# EAGLE design Callisto_MSO (EAGLE 9.6.2)
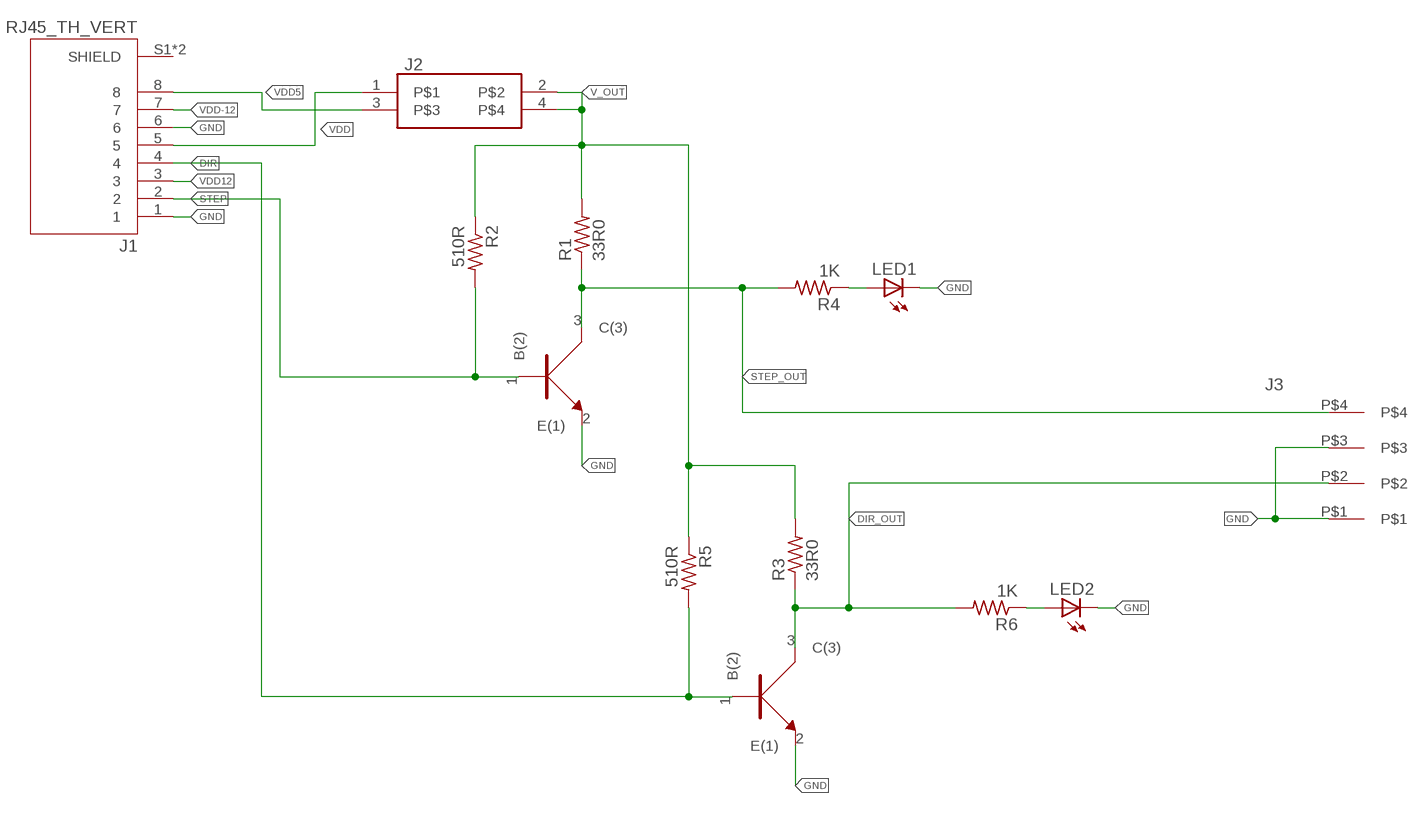
[diagram p0: schematic, sheet 1]

## Parts
J1  RJ45_TH_VERT  [ASSMANN_A-2014-2S-4-N-R]
J2  2.54MM_2_X_2_HEADER_GENERIC  [2X2]
J3  4-pos  3.81MM_1_X_4_RT_ANGLE_PLUG_HEADER  [1X4_3.81MM_PITCH]
LED1  Green  LED_0805_GREEN  [0805]
LED2  Green  LED_0805_GREEN  [0805]
R1  33R0  R_0402_1K0  [0402]
R2  510R  R_0402_1K0  [0402]
R3  33R0  R_0402_1K0  [0402]
R4  1K  R_0402_470R0  [0402]
R5  510R  R_0402_1K0  [0402]
R6  1K  R_0402_470R0  [0402]
U1  NPN  BC846BW  [SOT323]
U2  NPN  BC846BW  [SOT323]

## Nets
DIR: J1.4 R5.P$2 U2.1(B(2))
DIR_OUT: J3.P$2 R3.P$1 R6.P$2 U2.3(C(3))
GND: J1.1 J1.6 J3.P$1 J3.P$3 LED1.2(C) LED2.2(C) U1.2(E(1)) U2.2(E(1))
N$1: LED2.1(A) R6.P$1
N$2: LED1.1(A) R4.P$1
STEP: J1.2 R2.P$2 U1.1(B(2))
STEP_OUT: J3.P$4 R1.P$1 R4.P$2 U1.3(C(3))
V_OUT: J2.2 J2.4 R1.P$2 R2.P$1 R3.P$2 R5.P$1
VDD: J1.5 J2.1
VDD5: J1.8 J2.3
VDD12: J1.3
VDD-12: J1.7
Unconnected: J1.S1(SHIELD) J1.S2(SHIELD)

## Library data of the parts
J1 = 3D_MIG_Controller:RJ45_TH_VERT: Jack Modular Connector 8p8c (RJ45, Ethernet) Vertical Shielded; DESCRIPTION: Jack Modular Connector 8p8c (RJ45, Ethernet) Vertical Shielded; DIGI-KEY_PART_NUMBER: AE10399-ND; MF: Assmann WSW Components; MP: A-2014-2S-4-N-R; PACKAGE: None
J2 = 3D_MIG_Controller:2.54MM_2_X_2_HEADER_GENERIC
J3 = 3D_MIG_Controller:3.81MM_1_X_4_RT_ANGLE_PLUG_HEADER: 4 Position Terminal Block Header, Male Pins, Shrouded (4 Side) 0.150" (3.81mm) 90°, Right Angle - Through Hole; PARTNO: 691322310004
LED1 LED2 = 3D_MIG_Controller:LED_0805_GREEN: Green 570nm LED Indication - Discrete 2.2V 0805 (2012 Metric); PARTNO: LG R971-KN-1
R1-R3 R5 = 3D_MIG_Controller:R_0402_1K0; PARTNO: CRG0402J1K0; VALUE: 1K0
R4 R6 = 3D_MIG_Controller:R_0402_470R0; PARTNO: RMCF0402JT470R; VALUE: 470R0
U1 U2 = 3D_MIG_Controller:BC846BW: Bipolar (BJT) Transistor NPN 100MHz Surface Mount SOT-323; PARTNO: BC846BW_NPN

## Board
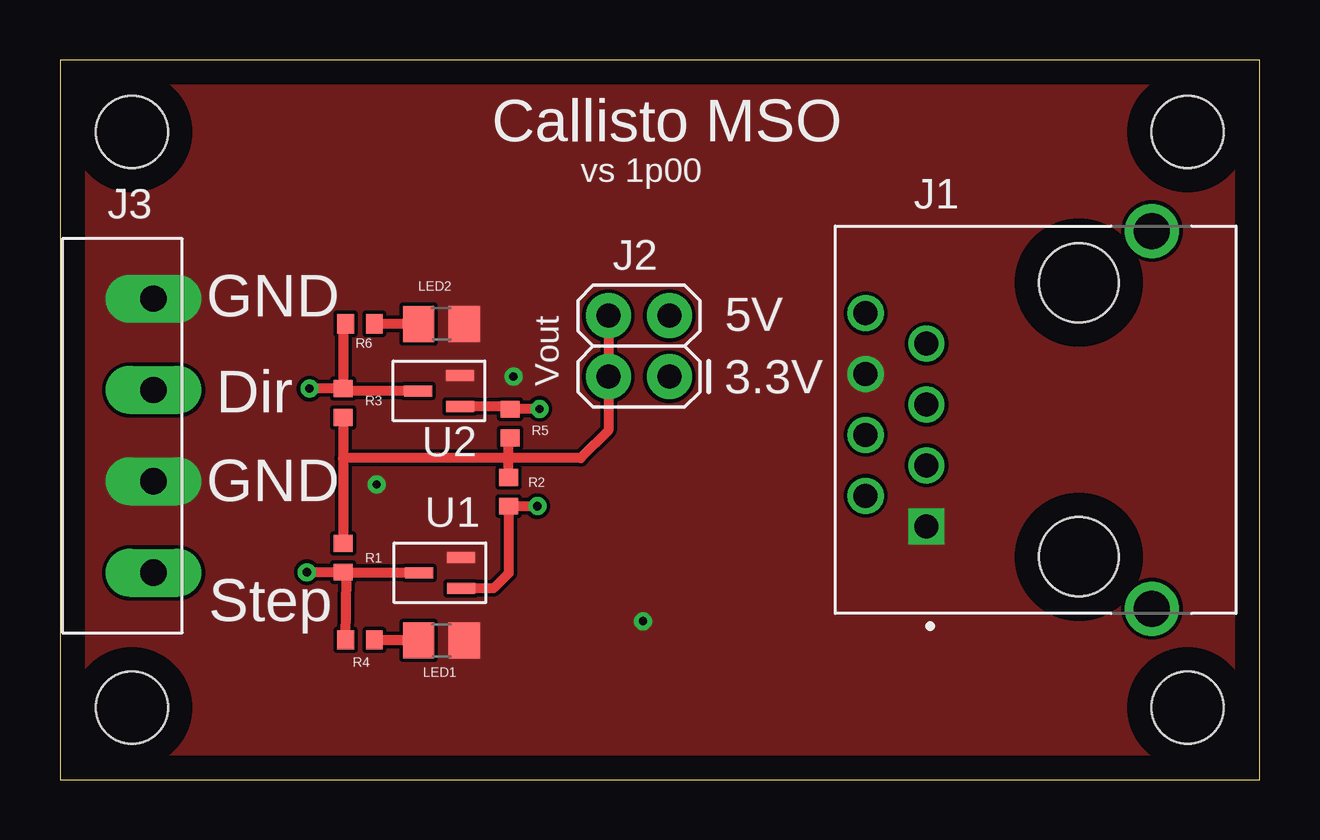
[diagram p1: board, top side]
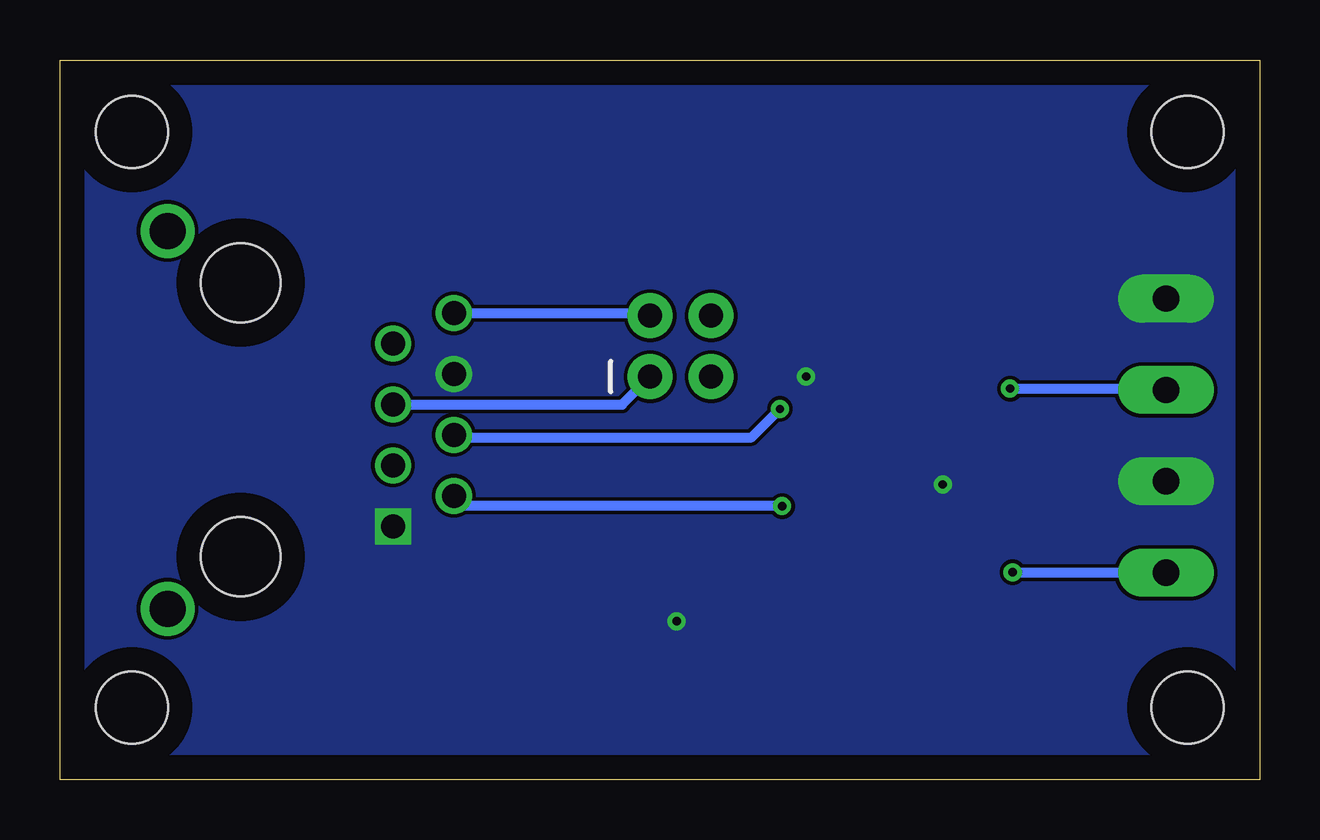
[diagram p2: board, bottom side, seen from below]

Size 50 x 30 mm. Coordinates in mm from the lower left corner, seen from the top.
Outline: 0,0 50,0 50,30 0,30 0,0
Copper layers (1*16): Top 0.035mm / dielectric 1.5mm / Bottom 0.035mm
Design rules "default": minimum track width 6mil, minimum drill 0.35mm, track to track 6mil, track to pad 6mil, pad to pad 6mil, via to via 6mil, smd to smd 6mil, copper to edge 40mil, drill to drill 6mil, minimum pad ring 10mil, minimum via ring 8mil, stop-mask expansion 4mil, vias tented up to drill 0mil, thermal gap 10mil
Holes 3 mm at 3,3 47,3 3,27 47,27

### Footprints (pad centres in the part's own frame; a part is rotated, then mirrored left to right if it is on the bottom)
ASSMANN_A-2014-2S-4-N-R = drill 1 square: 1 4.445,-6.35 | drill 1: 2 3.175,-8.89; 3 1.905,-6.35; 4 0.635,-8.89; 5 -0.635,-6.35; 6 -1.905,-8.89; 7 -3.175,-6.35; 8 -4.445,-8.89 | drill 1.5: S1 -7.875,3.05; S2 7.875,3.05 | hole 3.3: -5.715,0; 5.715,0
2X2 = drill 1 pad 1.88: 1 0,0; 2 0,2.54; 3 2.54,0; 4 2.54,2.54
1X4_3.81MM_PITCH = drill 1.1 pad 2 long: P$1 0,0; P$2 3.81,0; P$3 7.62,0; P$4 11.43,0
0805 = smd 1.3 x 1.5: 1 -0.95,0; 2 0.95,0
0402 = smd 0.8 x 0.7: P$1 0,0.6; P$2 0,-0.6
SOT323 = smd 0.457 x 1.168: 1 -0.65,-0.876; 2 0.65,-0.876; 3 0,0.876

### Placement (x,y rotation side)
J1  42.47,15 270 top
J2  25.4,16.8 90 top
J3  3.9,20.05 270 top
LED1  15.9,5.8 0 top
LED2  15.9,19 0 top
R1  11.8,9.25 180 top
R2  18.7,12 0 top
R3  11.8,15.7 0 top
R4  12.5,5.82 270 top
R5  18.76,14.84 180 top
R6  12.5,19 270 top
U1  15.84,8.62 90 top
U2  15.8,16.2 90 top

### Tracks (layer width: path | path; a pad name or v marks a point on that pad's centre or on a via)
DIR  (via drill 0.35)
  Top 0.406: U2.1 18.64,15.56 R5.P$2 v19.99,15.45
  Bottom 0.406: J1.4 33.48,14.27 21.18,14.27 v19.99,15.45
DIR_OUT  (via drill 0.35)
  Top 0.406: R3.P$1 v10.4,16.3 | U2.3 11.9,16.2 R3.P$1 | R6.P$2 11.8,18.86 R3.P$1
  Bottom 0.406: v10.4,16.3 3.96,16.3 J3.P$2
GND  (via drill 0.35)
  other vias: 18.9,16.8 13.2,12.3 24.3,6.6
  pour Top (no thermals): 0,30 50,30 50,0 0,0
  pour Bottom (no thermals): 0,30 50,30 50,0 0,0
N$1
  Top 0.406: LED2.1 R6.P$1
N$2
  Top 0.406: LED1.1 13.16,5.8 R4.P$1
STEP  (via drill 0.35)
  Top 0.406: v19.9,11.4 R2.P$2 18.7,8.6 18.07,7.97 U1.1
  Bottom 0.406: v19.9,11.4 19.93,11.43 33.18,11.43 J1.2
STEP_OUT  (via drill 0.35)
  Top 0.406: U1.3 11.84,8.62 R1.P$1 | R1.P$1 v10.29,8.64 | R4.P$2 11.94,8.5 R1.P$1
  Bottom 0.406: v10.29,8.64 3.92,8.64 J3.P$4
V_OUT
  Top 0.406: R2.P$1 18.7,13.4 | 18.7,13.4 18.7,14.18 R5.P$1 | 18.7,13.4 21.7,13.4 22.86,14.56 J2.2 J2.4 | R3.P$2 11.8,13.4 | 11.8,13.4 R1.P$2 | 18.7,13.4 11.8,13.4
VDD
  Bottom 0.406: J1.5 26.57,15.63 J2.1
VDD5
  Bottom 0.406: J1.8 25.5,19.45 J2.3

### Text on the board
tPlace: Callisto MSO | vs 1p00 | GND | 5V | Vout | 3.3V | Dir | GND | Step